# Altium schematic sheet usb_board.SchDoc
size A4
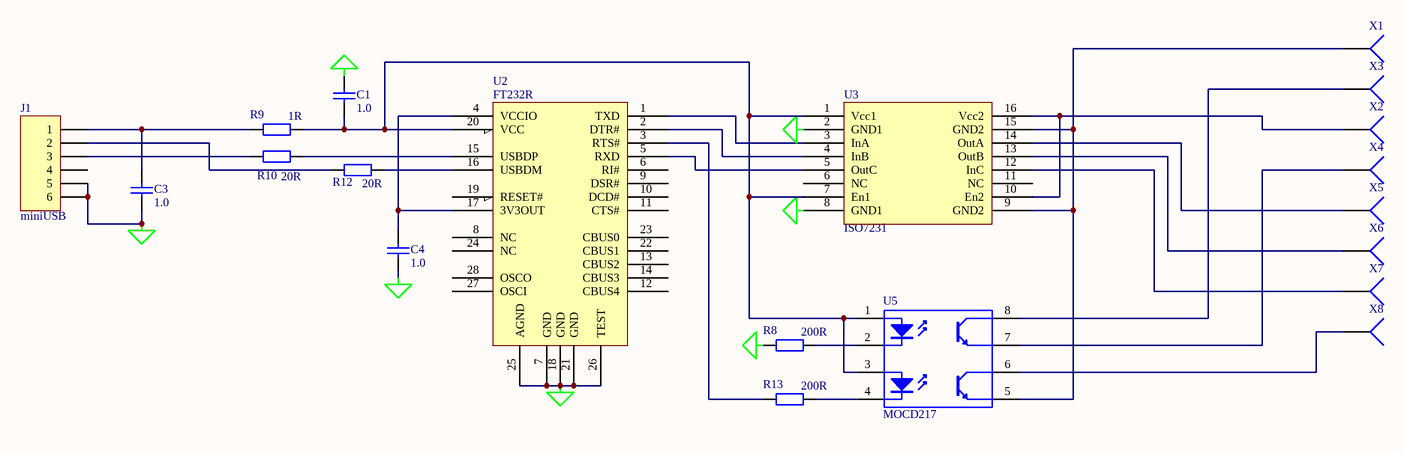
[diagram p0: usb_board.SchDoc]

## Parts
C1  1.0  [_0603]
C3  1.0  [_0603]
C4  1.0  [_0603]
J1  miniUSB  [USBmini]
R8  200R  [_0603]
R9  1R  [_0603]
R10  20R  [_0603]
R12  20R  [_0603]
R13  200R  [_0603]
U2  FT232R  [SOP65P780-28L]
U3  ISO7231
U5  MOCD217  [SO-G8]
X1  (no value)  [PIN1]
X2  (no value)  [PIN1]
X3  (no value)  [PIN1]
X4  (no value)  [PIN1]
X5  (no value)  [PIN1]
X6  (no value)  [PIN1]
X7  (no value)  [PIN1]
X8  (no value)  [PIN1]

## Nets
GND_USB: C1.1 C3.1 C4.1 J1.5 J1.6 R8.1 U2.7(GND) U2.18(GND) U2.21(GND) U2.25(AGND) U2.26(TEST) U3.2(GND1) U3.8(GND1)
NetC1_2: C1.2 R9.2 U2.20(VCC) U3.1(Vcc1) U3.7(En1) U5.1(A) U5.3(A)
NetC3_2: C3.2 J1.1 R9.1
NetC4_2: C4.2 U2.4(VCCIO) U2.17(3V3OUT)
NetJ1_2: J1.2 R12.1
NetJ1_3: J1.3 R10.1
NetR8_2: R8.2 U5.2(K)
NetR10_2: R10.2 U2.15(USBDP)
NetR12_2: R12.2 U2.16(USBDM)
NetR13_1: R13.1 U2.3(RTS#)
NetR13_2: R13.2 U5.4(K)
NetU2_1: U2.1(TXD) U3.3(InA)
NetU2_2: U2.2(DTR#) U3.4(InB)
NetU2_5: U2.5(RXD) U3.5(OutC)
NetU3_9: U3.9(GND2) U3.15(GND2) U5.5(E) X1.1
NetU3_10: U3.10(En2) U3.16(Vcc2) X2.1
NetU3_12: U3.12(InC) X7.1
NetU3_13: U3.13(OutB) X6.1
NetU3_14: U3.14(OutA) X5.1
NetU5_6: U5.6(C) X8.1
NetU5_7: U5.7(E) X4.1
NetU5_8: U5.8(C) X3.1

Not connected (* = marked no-connect by the designer): J1 4; U2 6(RI#) 8(NC) 9(DSR#) 10(DCD#) 11(CTS#) 12(CBUS4) 13(CBUS2) 14(CBUS3) 19(RESET#) 22(CBUS1) 23(CBUS0) 24(NC) 27(OSCI) 28(OSCO); U3 6(NC) 11(NC)

## Library data of the parts
C1 C3 C4 = Cap Semi: Capacitor (Semiconductor SIM Model); Manufacturer: Generic Components; Class I: Passive; Value: 1,0; Published: 8-Jun-2000; Revision: July-2002: Re-released for DXP Platform.; Publisher: Altium Limited; Class II: Capacitor
J1 = Header 6: Header, 6-Pin; Value: USB-B; LatestRevisionDate: 17-Jul-2002; LatestRevisionNote: Re-released for DXP Platform.; Publisher: Altium Limited
R8-R10 R12 R13 = RES: Body: 0603; Value: 22R; Type: S; Pins: 2
U2 = FT232R: Body: SSOP28LD; Value: FT232RL; Type: S; Pins: 20
U5 = MOCD217: Optic; Value: MOCD217
X1-X8 = Socket: Manufacturer: Generic Components; Class I: Connector; Revision: July-2002: Re-released for DXP Platform.; Publisher: Altium Limited